# Altium project CapstoneRadar.PrjPcb
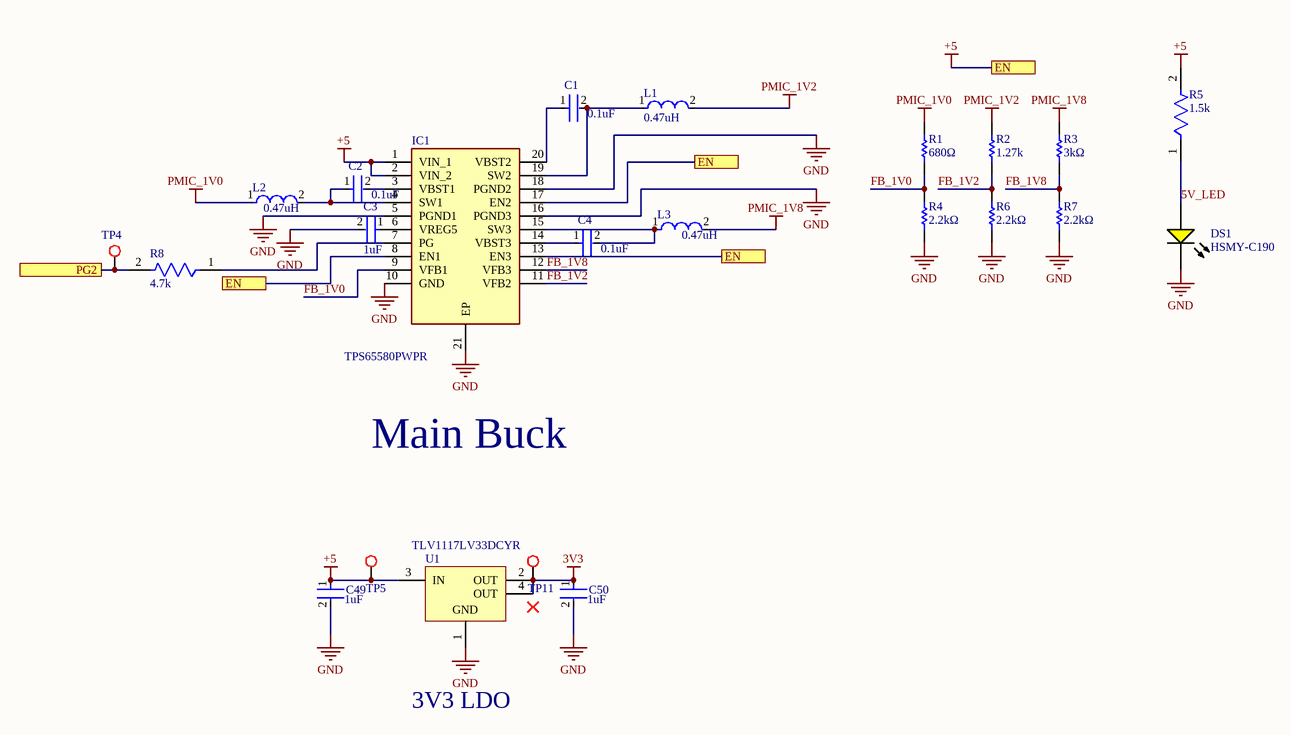
[diagram p0: Power.SchDoc]
4 sheets, 111 parts. Net scope: flat (ports and power ports of the same name join across sheets).
Board file: RadarPCB.PcbDoc
Sheets:
  Power.SchDoc
  IWRL6432.SchDoc
  Filters.SchDoc
  Connectors.SchDoc

## Sheet Power.SchDoc
size A4; SheetNumber: 1; SheetTotal: 4

### Parts
C1  0.1uF  [FP-0603-L_1_6_0_1-W_0_8_0-IPC_C]
C2  0.1uF  [FP-0603-L_1_6_0_1-W_0_8_0-IPC_C]
C3  1uF  [FP-CL10-IPC_C]
C4  0.1uF  [FP-0603-L_1_6_0_1-W_0_8_0-IPC_C]
C49  1uF  [FP-CL10-IPC_C]
C50  1uF  [FP-CL10-IPC_C]
DS1  HSMY-C190  [AVAG-HSMX-C190_V]
IC1  TPS65580PWPR  [SOP65P640X120-21N]
L1  0.47uH  [FP-IHLP-3232DZ-FP_2_413x5-MFG]
L2  0.47uH  [FP-IHLP-3232DZ-FP_2_413x5-MFG]
L3  0.47uH  [FP-IHLP-3232DZ-FP_2_413x5-MFG]
R1  680Ω  [RESC1608X55X30NL20T10]
R2  1.27k  [RESC1609X50X30NL10T20]
R3  3kΩ  [RESC1608X55X30NL20T10]
R4  2.2kΩ  [RESC1609X50X30NL10T20]
R5  1.5k  [FP-RC1608-IPC_B]
R6  2.2kΩ  [RESC1609X50X30NL10T20]
R7  2.2kΩ  [RESC1609X50X30NL10T20]
R8  4.7k  [FP-CRCW0603-HPe3-IPC_A]
TP4  TP_1  [Testpoint]  (value not drawn)
TP5  TP  [Testpoint]  (value not drawn)  (no BOM)
TP11  TP  [Testpoint]  (value not drawn)  (no BOM)
U1  TLV1117LV33DCYR  [DCY0004A_N]

### Ports
EN (see Power[1B], Power[3A]), EN (see Power[1B], Power[3A], Power[3B]), EN (see Power[3A], Power[3B]), PG2 (see IWRL6432[4C])

### Nets
3V3: C50.1 TP11.0 U1.2(OUT) U1.4(OUT)
+5: C49.1 IC1.1(VIN_1) IC1.2(VIN_2) IC1.8(EN1) IC1.13(EN3) IC1.17(EN2) R5.2 TP5.0 U1.3(IN) ; port EN
GND: C3.2 C49.2 C50.2 DS1.2(K) IC1.5(PGND1) IC1.10(GND) IC1.16(PGND3) IC1.18(PGND2) IC1.21(EP) R4.1 R6.1 R7.1 U1.1(GND)
PMIC_1V0: L2.1 R1.2
PMIC_1V2: L1.2 R2.2
PMIC_1V8: L3.2 R3.2
5V_LED: DS1.1(A) R5.1
FB_1V0: IC1.9(VFB1) R1.1 R4.2
FB_1V2: IC1.11(VFB2) R2.1 R6.2
FB_1V8: IC1.12(VFB3) R3.1 R7.2
NetC1_1: C1.1 IC1.20(VBST2)
NetC1_2: C1.2 IC1.19(SW2) L1.1
NetC2_1: C2.1 IC1.4(SW1) L2.2
NetC2_2: C2.2 IC1.3(VBST1)
NetC3_1: C3.1 IC1.6(VREG5)
NetC4_1: C4.1 IC1.14(VBST3)
NetC4_2: C4.2 IC1.15(SW3) L3.1
NetIC1_7: IC1.7(PG) R8.1
NetIC2_L10: R8.2 TP4.0 ; port PG2

### Notes on the sheet
- Main Buck
- 3V3 LDO

### Library data of the parts
C1 C2 C4 = CMP-14477-001640-2: None; Dielectric: X7R; Tolerance: 10%; Voltage Rating (DC): 25V; Capacitance: 100nF; Mount: Surface Mount; Thickness: 0.035inch; Packaging: Tape and Reel; Termination: SMD/SMT; Halogen Free: Halogen Free; RoHS Compliant: Yes; Case Code (Metric): 1608; Min Operating Temperature: -55°C; Width: 0.031inch; Voltage Rating: 25V; Package Quantity: 1; Case Code (Imperial): 0603; Ratings: AEC-Q200; Lead Free: Lead Free; Length: 0.063inch; Height: 0.8mm; Case/Package: 0603; Max Operating Temperature: 125°C
C3 C49 C50 = CMP-13271-003399-1: Cap Ceramic 1uF 10V X5R ±10% Pad SMD 0603 +85°C T/R; Min Operating Temperature: -55°C; Max Operating Temperature: 85°C; Dielectric: X5R; Contact Plating: Tin; Height: 0.8mm; Voltage: 10V; Packaging: Tape and Reel; Voltage Rating: 10V; Capacitance: 1uF; Package Quantity: 1; Width: 0.031inch; Length: 1.6mm; Depth: 0.8mm; Case/Package: 0603; Case Code (Imperial): 0603; Thickness: 0.035inch; Radiation Hardening: No; Tolerance: 10%; Case Code (Metric): 1608; Mount: Surface Mount
DS1 = CMP-1744-00003-1: LED Uni-Color Yellow, 65 mW, 20 mA, -40 to 85 degC, 2-Pin SMD, RoHS, Tape and Reel; Tolerance: 1%; Voltage Rating: 50 V; Power Rating: 100 mW; Case\Package: 0603; Resistance: 390 Ohm; Min Operating Temperature: -55 degC; Length: 1.6 mm; ComponentLink3Description: Package Specification; Mount: Surface Mount; PackageReference: HSMX-C190; ComponentLink2Description: Datasheet; DatasheetVersion: Mar-12; Case Code (Metric): 1608; Pins: 2; Package Quantity: 5000; ComponentLink2URL: http://docs.avagotech.com/docs/AV02-0551EN; ComponentLink1Description: Manufacturer URL; RoHSCompliant: true; Packaging: Tape and Reel; PackageDescription: 2-Pin Surface Mount Device, Body 1.6 x 0.8 mm, Height 0.9 mm; REACH SVHC: No SVHC; ComponentLink3URL: http://www.fairchildsemi.com/dwg/MA/MA03D.pdf; Voltage Rating (DC): 50 V; Width: 0.8 mm; ComponentLink1URL: http://www.avagotech.com/; Max Operating Temperature: 155 degC; Case Code (Imperial): 0603; Height: 0.45 mm
IC1 = TPS65580PWPR: Integrated Circuit; Manufacturer_Name: Texas Instruments; Datasheet Link: http://www.ti.com/lit/gpn/tps65580; Height: 1.2mm; Manufacturer_Part_Number: TPS65580PWPR; Mouser Part Number: 595-TPS65580PWPR; Mouser Price/Stock: https://www.mouser.co.uk/ProductDetail/Texas-Instruments/TPS65580PWPR?qs=igp4D3uu33KIVxsJeGysbA%3D%3D; Arrow Part Number: TPS65580PWPR; Arrow Price/Stock: https://www.arrow.com/en/products/tps65580pwpr/texas-instruments?region=nac
L1-L3 = CMP-02424-000394-1: Commercial Inductors, Low DCR Series 0.47uH 25A 2.38mΩ 20%; Shielding: Shielded; Saturation Current: 14A; Core Material: Ferrite; Test Frequency: 100kHz; Self Resonant Frequency: 80MHz; Inductance: 470nH; DC Resistance (DCR): 2.38mR; Tolerance: 20%; Length: 0.34inch; Width: 0.322inch; Height: 4mm; Case/Package: 3232; Height - Seated (Max): 0.157inch; Termination: SMD/SMT; Inductance Tolerance: 20%; Depth: 8.94mm; Number of Pins: 2; Radiation Hardening: No; Min Operating Temperature: -55°C; Package Quantity: 500; Current Rating: 25A; Mount: Surface Mount; RMS Current (Irms): 25A; Military Standard: Not; Max Operating Temperature: 125°C; Lead Free: Lead Free; Max DC Current: 14A; Packaging: Tape and Reel
R1 = CMP-2000-01638-1: Manufacturer: KOA Speer; Part Number: RK73H1JTTD6800F
R2 = CMP-1012-00521-2: Part Number: CRCW06031K27FKEA; Manufacturer: Vishay Dale
R3 = CMP-2000-01790-1: Manufacturer: KOA Speer; Part Number: SG73P1JTTD3001F
R4 R6 R7 = CMP-2000-03167-1: Part Number: CRCW06032K20FKEA; Manufacturer: Vishay Dale
R5 = CMP-13261-004935-1: Res Thick Film 0603 1.5kΩ 1% 0.1W ±100ppm/°C Molded SMD T/R; Resistance: 1.5kR; Voltage Rating (DC): 50V; Power Rating: 100mW; Contact Plating: Tin; Depth: 0.8mm; Width: 800um; Tolerance: 1%; Lead Free: Lead Free; Composition: Thick Film; Military Standard: Not; Temperature Coefficient: 100ppm/°C; Radiation Hardening: No; Length: 1.6mm; Case/Package: 0603; Max Operating Temperature: 155°C; Packaging: Tape and Reel; Min Operating Temperature: -55°C
R8 = CMP-2000-03414-2: RES Thick Film, 4.7kΩ, 5%, 0.33W, 200ppm/°C, 0603; Max Power Dissipation: 250mW; Voltage Rating: 75V; Resistance: 4.7kR; Case/Package: 0603; Lead Free: Lead Free; Tolerance: 5%; Max Operating Temperature: 155°C; RoHS Compliant: Yes; Power Rating: 250mW; Features: Automotive AEC-Q200; Resistor Type: Thick Film; Weight: 7.1E-05oz; Width: 0.033inch; Packaging: Tape and Reel; Case Code (Imperial): 0603; Package Quantity: 1; Contact Plating: Tin; Number of Terminations: 2; Min Operating Temperature: -55°C; Radiation Hardening: No; Case Code (Metric): 1608; Temperature Coefficient: 200ppm/°C; Height: 0.022inch; Length: 0.063inch; Series: CRCW-HP
TP4 TP5 TP11 = Testpoint
U1 = CMP-0395-00503-2: Single Output LDO, 1 A, Fixed 3.3 V Output, 2 to 5.5 V Input, 4-pin SOT-223 (DCY), -40 to 125 degC, Green (RoHS & no Sb/Br); Manufacturer: Texas Instruments; Vout Adj(Min)(V): 3.3; Vdo(Typ)(mV): 1200; Iq(Typ)(mA): 0.05; Accuracy(%): 2; Iout(Max)(A): 1; SubFamily: Single Channel LDO; Vin(Max)(V): 5.5; PackageReference: DCY0004A; PackageDescription: 4-Pin Plastic Small Outline, Body 3.5 x 6.5 mm, Pitch 2.3 mm; Vout Adj(Max)(V): 3.3; Mounting Technology: Surface Mount; ComponentLink2Description: Datasheet; ComponentLink1Description: Manufacturer URL; PartNumber: TLV1117LV33DCYR; ComponentLink3Description: Package Specification; ComponentLink1URL: http://www.ti.com/; ComponentLink2URL: http://www.ti.com/general/docs/lit/getliterature.tsp?genericPartNumber=TLV1117LV33&fileType=pdf; Fixed Output Options(V): 3.3; PackageVersion: 4202506/B; Vin(Min)(V): 2; DatasheetVersion: SBVS160A; Eco-Plan: Green (RoHS & no Sb/Br); ComponentLink3URL: http://www.ti.com/litv/pdf/mpds094a; Code_JEDEC: TO-261

## Sheet IWRL6432.SchDoc
size A4; SheetNumber: 2; SheetTotal: 4
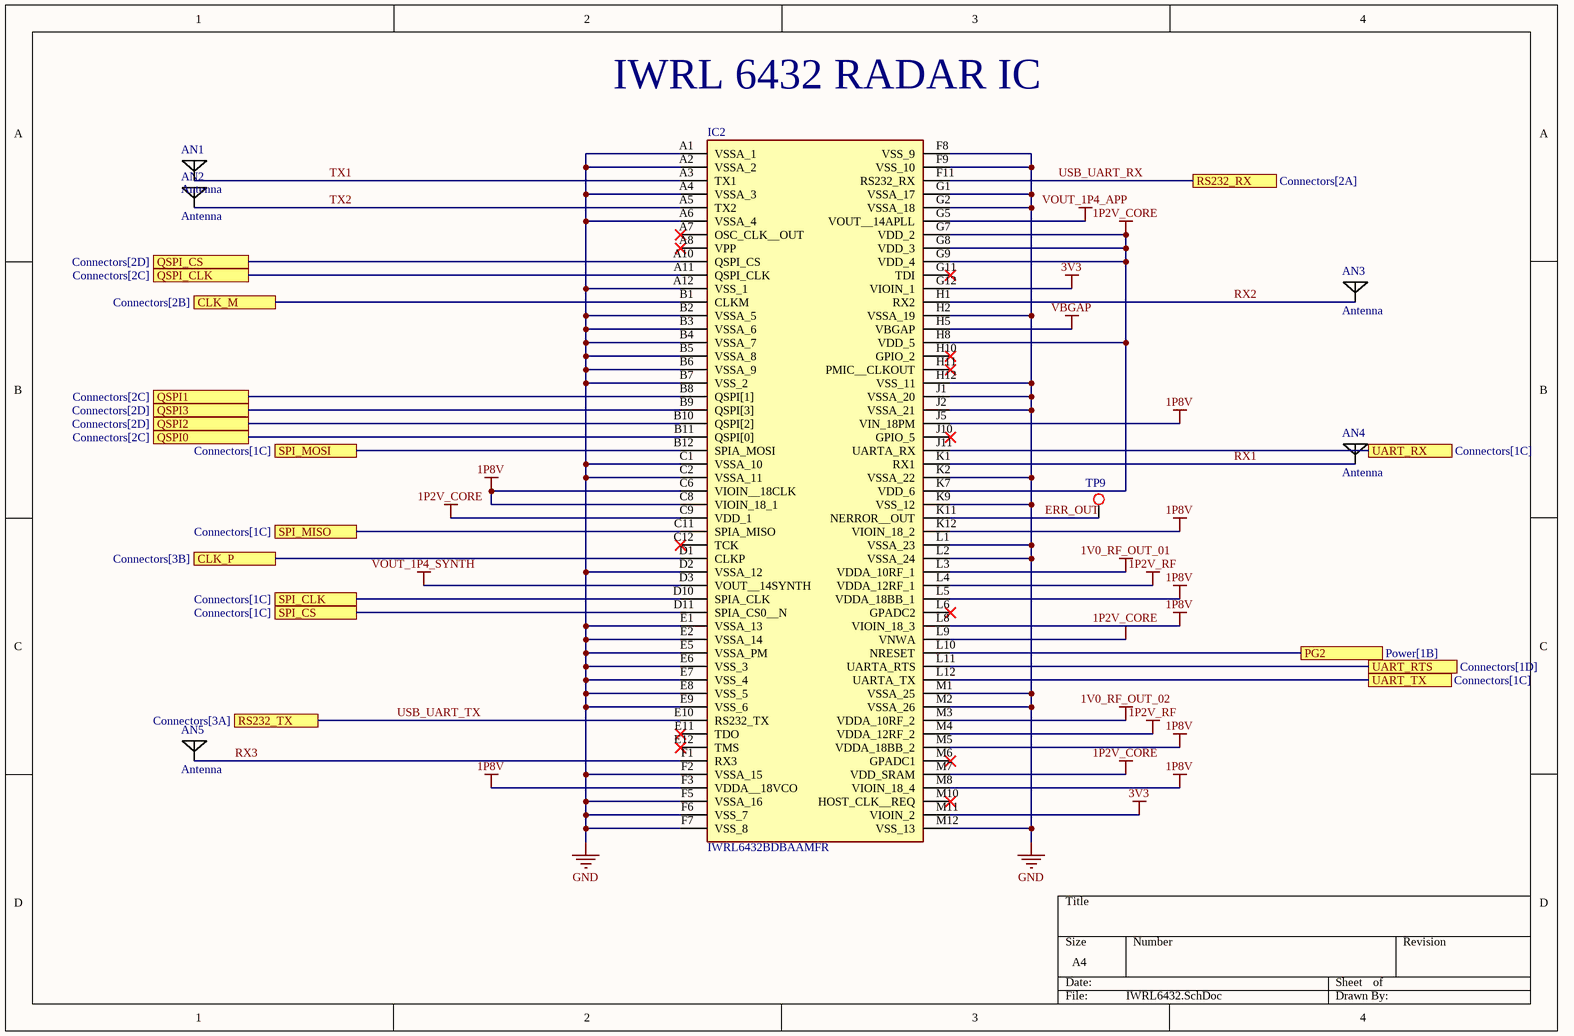
[diagram p1: IWRL6432.SchDoc]

### Parts
AN1  Antenna  [Antenna]
AN2  Antenna  [Antenna]
AN3  Antenna  [Antenna]
AN4  Antenna  [Antenna]
AN5  Antenna  [Antenna]
IC2  IWRL6432BDBAAMFR  [BGA102C50P12X12_645X645X97]
TP9  TP_1  [Testpoint]  (value not drawn)

### Ports
CLK_M (see Connectors[2B]), CLK_P (see Connectors[3B]), PG2 (see Power[1B]), QSPI0 (see Connectors[2C]), QSPI1 (see Connectors[2C]), QSPI2 (see Connectors[2D]), QSPI3 (see Connectors[2D]), QSPI_CLK (see Connectors[2C]), QSPI_CS (see Connectors[2D]), RS232_RX (see Connectors[2A]), RS232_TX (see Connectors[3A]), SPI_CLK (see Connectors[1C]), SPI_CS (see Connectors[1C]), SPI_MISO (see Connectors[1C]), SPI_MOSI (see Connectors[1C]), UART_RTS (see Connectors[1D]), UART_RX (see Connectors[1C]), UART_TX (see Connectors[1C])

### Nets
1P2V_CORE: IC2.C9(VDD_1) IC2.G7(VDD_2) IC2.G8(VDD_3) IC2.G9(VDD_4) IC2.H8(VDD_5) IC2.K7(VDD_6) IC2.L9(VNWA) IC2.M7(VDD_SRAM)
1P2V_RF: IC2.L4(VDDA_12RF_1) IC2.M4(VDDA_12RF_2)
1P8V: IC2.C6(VIOIN__18CLK) IC2.C8(VIOIN_18_1) IC2.F3(VDDA__18VCO) IC2.J5(VIN_18PM) IC2.K12(VIOIN_18_2) IC2.L5(VDDA_18BB_1) IC2.L8(VIOIN_18_3) IC2.M5(VDDA_18BB_2) IC2.M8(VIOIN_18_4)
1V0_RF_OUT_01: IC2.L3(VDDA_10RF_1)
1V0_RF_OUT_02: IC2.M3(VDDA_10RF_2)
3V3: IC2.G12(VIOIN_1) IC2.M11(VIOIN_2)
GND: IC2.A1(VSSA_1) IC2.A2(VSSA_2) IC2.A4(VSSA_3) IC2.A6(VSSA_4) IC2.A12(VSS_1) IC2.B2(VSSA_5) IC2.B3(VSSA_6) IC2.B4(VSSA_7) IC2.B5(VSSA_8) IC2.B6(VSSA_9) IC2.B7(VSS_2) IC2.C1(VSSA_10) IC2.C2(VSSA_11) IC2.D2(VSSA_12) IC2.E1(VSSA_13) IC2.E2(VSSA_14) IC2.E5(VSSA_PM) IC2.E6(VSS_3) IC2.E7(VSS_4) IC2.E8(VSS_5) IC2.E9(VSS_6) IC2.F2(VSSA_15) IC2.F5(VSSA_16) IC2.F6(VSS_7) IC2.F7(VSS_8) IC2.F8(VSS_9) IC2.F9(VSS_10) IC2.G1(VSSA_17) IC2.G2(VSSA_18) IC2.H2(VSSA_19) IC2.H12(VSS_11) IC2.J1(VSSA_20) IC2.J2(VSSA_21) IC2.K2(VSSA_22) IC2.K9(VSS_12) IC2.L1(VSSA_23) IC2.L2(VSSA_24) IC2.M1(VSSA_25) IC2.M2(VSSA_26) IC2.M12(VSS_13)
VBGAP: IC2.H5(VBGAP)
VOUT_1P4_APP: IC2.G5(VOUT__14APLL)
VOUT_1P4_SYNTH: IC2.D3(VOUT__14SYNTH)
ERR_OUT: IC2.K11(NERROR__OUT) TP9.0
QSPI_0: IC2.B11(QSPI[0]) ; port QSPI0
QSPI_1: IC2.B8(QSPI[1]) ; port QSPI1
QSPI_2: IC2.B10(QSPI[2]) ; port QSPI2
QSPI_3: IC2.B9(QSPI[3]) ; port QSPI3
QSPI_CLK: IC2.A11(QSPI_CLK) ; port QSPI_CLK
QSPI_CS: IC2.A10(QSPI_CS) ; port QSPI_CS
RX1: AN4.0 IC2.K1(RX1)
RX2: AN3.0 IC2.H1(RX2)
RX3: AN5.0 IC2.F1(RX3)
SPI_CLK: IC2.D10(SPIA_CLK) ; port SPI_CLK
SPI_CS: IC2.D11(SPIA_CS0__N) ; port SPI_CS
SPI_MISO: IC2.C11(SPIA_MISO) ; port SPI_MISO
SPI_MOSI: IC2.B12(SPIA_MOSI) ; port SPI_MOSI
TX1: AN1.0 IC2.A3(TX1)
TX2: AN2.0 IC2.A5(TX2)
UART_RTS: IC2.L11(UARTA_RTS) ; port UART_RTS
UART_RX: IC2.J11(UARTA_RX) ; port UART_RX
UART_TX: IC2.L12(UARTA_TX) ; port UART_TX
USB_UART_RX: IC2.F11(RS232_RX) ; port RS232_RX
USB_UART_TX: IC2.E10(RS232_TX) ; port RS232_TX
NetC53_1: IC2.B1(CLKM) ; port CLK_M
NetC54_1: IC2.D1(CLKP) ; port CLK_P
NetIC2_L10: IC2.L10(NRESET) ; port PG2

Not connected (* = marked no-connect by the designer): IC2 A7(OSC_CLK__OUT)* A8(VPP)* C12(TCK)* E11(TDO)* E12(TMS)* G11(TDI)* H10(GPIO_2)* H11(PMIC__CLKOUT)* J10(GPIO_5)* L6(GPADC2)* M6(GPADC1)* M10(HOST_CLK__REQ)*

### Notes on the sheet
- IWRL 6432 RADAR IC

### Library data of the parts
IC2 = IWRL6432BDBAAMFR: Integrated Circuit; Manufacturer_Name: Texas Instruments; Datasheet Link: https://www.ti.com/lit/ds/symlink/iwrl6432.pdf; Height: 0.97mm; Manufacturer_Part_Number: IWRL6432BDBAAMFR
TP9 = Testpoint

## Sheet Filters.SchDoc
size A4; SheetNumber: 3; SheetTotal: 4
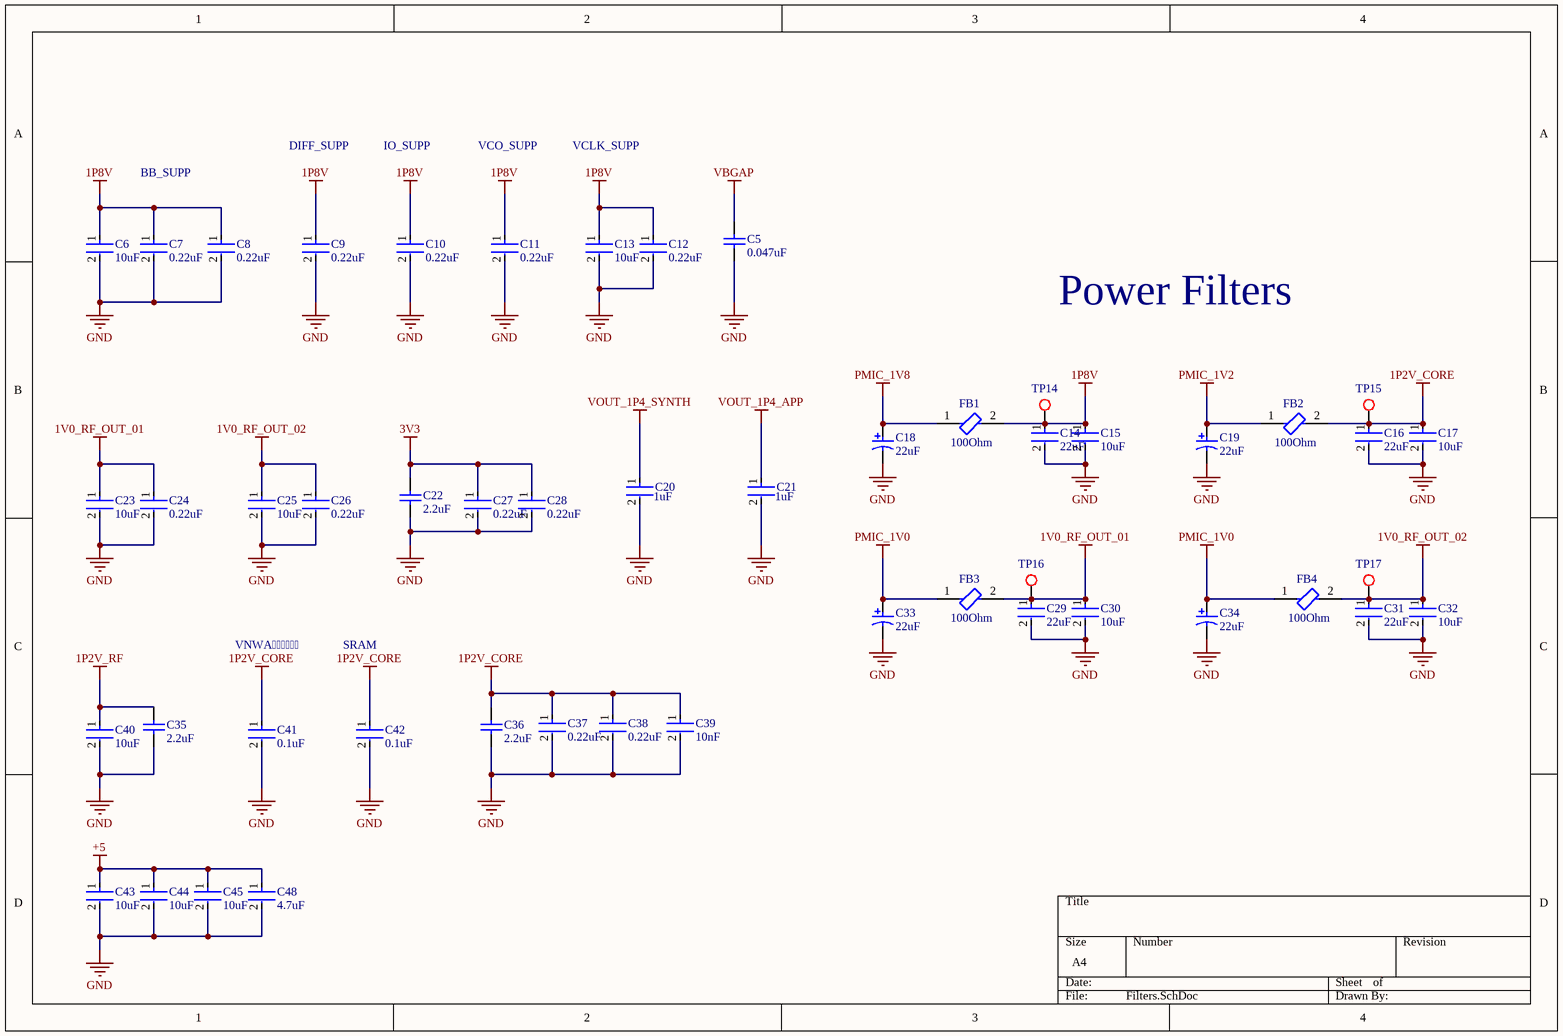
[diagram p2: Filters.SchDoc]

### Parts
C5  0.047uF  [CAPC1608X90X35NL15T15]
C6  10uF  [FP-GRM18-0_15-MFG]
C7  0.22uF  [FP-C0603C-CF-MFG]
C8  0.22uF  [FP-C0603C-CF-MFG]
C9  0.22uF  [FP-C0603C-CF-MFG]
C10  0.22uF  [FP-C0603C-CF-MFG]
C11  0.22uF  [FP-C0603C-CF-MFG]
C12  0.22uF  [FP-C0603C-CF-MFG]
C13  10uF  [FP-GRM18-0_15-MFG]
C14  22uF  [FP-CL21-IPC_C]
C15  10uF  [FP-GRM18-0_15-MFG]
C16  22uF  [FP-CL21-IPC_C]
C17  10uF  [FP-GRM18-0_15-MFG]
C18  22uF  [NIC-CAPA2-4X5.8_V]
C19  22uF  [NIC-CAPA2-4X5.8_V]
C20  1uF  [FP-CL10-IPC_C]
C21  1uF  [FP-CL10-IPC_C]
C22  2.2uF  [CAPC0603(1608)100_N]
C23  10uF  [FP-GRM18-0_15-MFG]
C24  0.22uF  [FP-C0603C-CF-MFG]
C25  10uF  [FP-GRM18-0_15-MFG]
C26  0.22uF  [FP-C0603C-CF-MFG]
C27  0.22uF  [FP-C0603C-CF-MFG]
C28  0.22uF  [FP-C0603C-CF-MFG]
C29  22uF  [FP-CL21-IPC_C]
C30  10uF  [FP-GRM18-0_15-MFG]
C31  22uF  [FP-CL21-IPC_C]
C32  10uF  [FP-GRM18-0_15-MFG]
C33  22uF  [NIC-CAPA2-4X5.8_V]
C34  22uF  [NIC-CAPA2-4X5.8_V]
C35  2.2uF  [CAPC0603(1608)100_N]
C36  2.2uF  [CAPC0603(1608)100_N]
C37  0.22uF  [FP-C0603C-CF-MFG]
C38  0.22uF  [FP-C0603C-CF-MFG]
C39  10nF  [FP-CGA3E-0_3-0_1-IPC_A]
C40  10uF  [FP-GRM18-0_15-MFG]
C41  0.1uF  [FP-CC0603-DA-MFG]
C42  0.1uF  [FP-CC0603-DA-MFG]
C43  10uF  [FP-GRM18-0_15-MFG]
C44  10uF  [FP-GRM18-0_15-MFG]
C45  10uF  [FP-GRM18-0_15-MFG]
C48  4.7uF  [FP-CL10-IPC_A]
FB1  100Ohm  [FP-MPZ1608-0_8-MFG]
FB2  100Ohm  [FP-MPZ1608-0_8-MFG]
FB3  100Ohm  [FP-MPZ1608-0_8-MFG]
FB4  100Ohm  [FP-MPZ1608-0_8-MFG]
TP14  TP_1  [Testpoint]  (value not drawn)
TP15  TP_1  [Testpoint]  (value not drawn)
TP16  TP_1  [Testpoint]  (value not drawn)
TP17  TP_1  [Testpoint]  (value not drawn)

### Nets
1P2V_CORE: C16.1 C17.1 C36.2 C37.1 C38.1 C39.1 C41.1 C42.1 FB2.2 TP15.0
1P2V_RF: C35.2 C40.1
1P8V: C6.1 C7.1 C8.1 C9.1 C10.1 C11.1 C12.1 C13.1 C14.1 C15.1 FB1.2 TP14.0
1V0_RF_OUT_01: C23.1 C24.1 C29.1 C30.1 FB3.2 TP16.0
1V0_RF_OUT_02: C25.1 C26.1 C31.1 C32.1 FB4.2 TP17.0
3V3: C22.2 C27.1 C28.1
+5: C43.1 C44.1 C45.1 C48.1
GND: C5.1 C6.2 C7.2 C8.2 C9.2 C10.2 C11.2 C12.2 C13.2 C14.2 C15.2 C16.2 C17.2 C18.2 C19.2 C20.2 C21.2 C22.1 C23.2 C24.2 C25.2 C26.2 C27.2 C28.2 C29.2 C30.2 C31.2 C32.2 C33.2 C34.2 C35.1 C36.1 C37.2 C38.2 C39.2 C40.2 C41.2 C42.2 C43.2 C44.2 C45.2 C48.2
PMIC_1V0: C33.1 C34.1 FB3.1 FB4.1
PMIC_1V2: C19.1 FB2.1
PMIC_1V8: C18.1 FB1.1
VBGAP: C5.2
VOUT_1P4_APP: C21.1
VOUT_1P4_SYNTH: C20.1

### Notes on the sheet
- BB_SUPP
- DIFF_SUPP
- IO_SUPP
- VCO_SUPP
- VCLK_SUPP
- Power Filters
- VNWA
- SRAM

### Library data of the parts
C5 = CMP-2006-02145-1: Manufacturer: AVX Interconnect / Elco; Part Number: 06035F473K4T2A
C6 C13 C15 C17 C23 C25 C30 C32 C40 C43-C45 = CMP-2000-05448-2: CAP CER 10UF 10V X5R 0603; Manufacturer Part Number: GRM188R61A106KE69D; Manufacturer: Murata; Temperature Coefficient: 15%; Material: Ceramic; Tolerance: 10%; Device Class L1: Passive Components; ComponentLink2Description: Datasheet; Height: 0.95mm; Package: GRM18-0.15; Octopart: https://octopart.com/grm188r61a106ke69d-murata-22851381; Value: 10uF; Digikey Description: CAP CER 10UF 10V X5R 0603; Temperature Range High: +85°C; Temperature Range Low: -55°C; Temperature Characteristic: X5R; Capacitance: 10uF; RoHS: TRUE; Device Class L2: Capacitors; ComponentLink2URL: https://search.murata.co.jp/Ceramy/image/img/A01X/G101/ENG/GRM188R61A106KE69-01A.pdf; Device Class L3: Ceramic Capacitors; Lead Free: Yes; Mouser Description: Multilayer Ceramic Capacitors MLCC - SMD/SMT 0603 10uF 10volts X5R + - 10%; Category: Cap; Voltage Rating: 10V; Temperature: -55°C to +85°C; Automotive: No
C7-C12 C24 C26-C28 C37 C38 = CMP-03020-026996-1: C0603 0.22 μF X7R 30ppm/°C 10.00% 10 V; Manufacturer Part Number: C0603C224K8RAC; Manufacturer: KEMET; Capacitance: 0.22 μF; Automotive Grade: Grade 1; Material: Ceramic; Value: 0.22 μF; Voltage Rating: 10 V; Tolerance: 0.1; Device Class L2: Capacitors; Temperature Range High: +125°C; RoHS: TRUE; Device Class L1: Passive Components; Temperature: -55°C to +125°C; Temperature Coefficient: 30ppm/°C; ComponentLink2Description: Datasheet; Device Class L3: Ceramic Capacitors; ComponentLink2URL: https://api.kemet.com/component-edge/download/datasheet/C0603C100J5GACAUTO.pdf; Category: Cap; Lead Free: Yes; Automotive: Yes; Height: 0.87mm; Temperature Characteristic: X7R; Mouser Description: Multilayer Ceramic Capacitors MLCC - SMD/SMT 50volts 0.22 uF C0G X7R; Octopart: https://octopart.com/c0603c224k8rac-kemet-7455784; Package: C0603C-CF; Temperature Range Low: -55°C
C14 C16 C29 C31 = CMP-13271-003019-1: CL21 Series 0805 22uF 4V ±20% Tolerance X6S Multilayer Ceramic Chip Capacitor; Capacitance: 22uF; Packaging: Tape and Reel; Depth: 1.25mm; Mount: Surface Mount; Width: 0.049inch; Min Operating Temperature: -55°C; Case/Package: 0805; Max Operating Temperature: 105°C; Package Quantity: 1; Case Code (Metric): 2012; Voltage Rating: 4V; Radiation Hardening: No; Dielectric: X6S; Thickness: 0.055inch; Case Code (Imperial): 0805; Length: 2mm; Tolerance: 20%; Height: 1.25mm
C18 C19 C33 C34 = CMP-0687-00010-1: Aluminum Electrolytic Capacitor, UD Series, Low Impedance, 22 uF, 10 V, + / - 20%, -55 to 105 degC, Chip Type, 4 x 5.8 mm D x L, Pb-Free, Reel; Manufacturer: Nichicon; PartNumber: UUD1A220MCL1GS; Endurance Time: 2000 h; Packing: Dia382mm Reel; Tolerance Rated Capacitance: -20 to 20%; Rated Ripple Current (at 100kHz): 80 mA; Impedance: 1.8 Ohm; Rated Voltage: 10 V; ComponentLink3URL: http://products.nichicon.co.jp/en/pdf/XJA043/e-ud.pdf; ComponentLink2URL: http://products.nichicon.co.jp/en/pdf/XJA043/e-ud.pdf; ComponentLink2Description: Datasheet; ComponentLink1URL: http://www.nichicon.co.jp/; DatasheetVersion: 08/2012; PackageDescription: 2-Pin Surface Mount Device, Diameter 4 mm, Height 5.8 mm, Pitch 3.6 mm; PackageReference: CAPAE-D4H5.8; ComponentLink1Description: Manufacturer URL; Rated Capacitance: 22 uF; Length: 5.8 mm; Diameter: 4 mm; ComponentLink3Description: Package Specification; Mounting Technology: Surface Mount; RoHS: TRUE
C20 C21 = CMP-13271-003399-1: as C3 on sheet Power; Min Operating Temperature: -55°C; Max Operating Temperature: 85°C; Dielectric: X5R; Contact Plating: Tin; Height: 0.8mm; Voltage: 10V; Packaging: Tape and Reel; Voltage Rating: 10V; Capacitance: 1uF; Package Quantity: 1; Width: 0.031inch; Length: 1.6mm; Depth: 0.8mm; Case/Package: 0603; Case Code (Imperial): 0603; Thickness: 0.035inch; Radiation Hardening: No; Tolerance: 10%; Case Code (Metric): 1608; Mount: Surface Mount
C22 C35 C36 = CMP-1035-02766-1: CAP 2.2uF 16V -20% to +80% 0603 (1608 Metric) Thickness 1mm SMD; Case-Metric: 1608; Case-EIA: 0603; Value: 2.2uF; Rated Voltage: 16 V; Tolerance: -20% to +80%; Technology: SMT; Max Thickness: 1 mm
C39 = CMP-08246-000769-1: Cap Ceramic 10nF 100V X8R 10% Pad SMD 0603 +150°C Automotive T/R; Mount: Surface Mount; Voltage Rating (DC): 100V; Termination: SMD/SMT; Dielectric: X8R; Case/Package: 0603; Ratings: AEC-Q200; Voltage Rating: 100V; Capacitance: 10nF; Packaging: Tape and Reel; Thickness: 0.035inch; Composition: Ceramic; Max Operating Temperature: 150°C; Width: 0.031inch; Height: 0.8mm; Weight: 7.1E-05oz; Depth: 0.8mm; Min Operating Temperature: -55°C; Length: 1.6mm; Case Code (Metric): 1608; Tolerance: 10%; Package Quantity: 4000; Case Code (Imperial): 0603
C41 C42 = CMP-03422-001228-1: CAP CER 0.1UF 10V X7R 0603; Manufacturer Part Number: CC0603KRX7R6BB104; Manufacturer: YAGEO; Material: Ceramic; Tolerance: 0.1; Capacitance: 100 nF; Temperature Coefficient: 15%; Value: 100 nF; Height: 0.9mm; RoHS: TRUE; Footprint Url: http://www.yageo.com/exep/pages/download/literatures/UPY-C_GEN_24.pdf; Octopart: https://octopart.com/cc0603krx7r6bb104-yageo-9291607; Device Class L1: Passive Components; Mouser Description: 0603 0.1 uF 10 V ±10 % Tolerance X7R SMT Multilayer Ceramic Capacitor; ComponentLink2URL: http://www.yageo.com/documents/recent/UPY-GPHC_X7R_6.3V-to-50V_18.pdf; Automotive: No; Voltage: 10 V; Device Class L3: Ceramic Capacitors; Category: Cap; Temperature: -55°C to +125°C; ComponentLink2Description: Datasheet; Voltage Rating: 10 V; Device Class L2: Capacitors; Lead Free: Yes; Temperature Range High: +125°C; Temperature Range Low: -55°C; Digikey Description: CAP CER 0.1UF 10V X7R 0603; Package: CC0603-DA; Temperature Characteristic: X7R
C48 = CMP-13271-001817-1: Cap Ceramic 4.7uF 6.3V X6S ±10% Pad SMD 0603 +105°C T/R; Length: 1.6mm; Tolerance: 10%; Packaging: Tape and Reel; Dielectric: X6S; Lead Free: Lead Free; Package Quantity: 1; Case/Package: 0603; Max Operating Temperature: 105°C; Radiation Hardening: No; Thickness: 0.035inch; Depth: 0.8mm; Capacitance: 4.7uF; Case Code (Metric): 1608; Voltage Rating (DC): 6.3V; Height: 0.8mm; Voltage Rating: 6.3V; Mount: Surface Mount; Min Operating Temperature: -55°C; Case Code (Imperial): 0603; Width: 0.031inch
FB1-FB4 = CMP-08257-000073-1: Power line Ferrite Bead 100Ω @ 100MHz 2A DCR 0.04Ω AEC-Q200 SMD 0603; Impedance: 100R; Tolerance: 25%; Number of Lines: 1; DC Resistance (DCR): 40mR; Termination: SMD/SMT; Case Code (Imperial): 0603; RoHS Compliant: Yes; Weight: 7.1E-05oz; Case Code (Metric): 1608; Width: 0.031inch; Max DC Current: 2A; Mount: Surface Mount; Packaging: Tape and Reel; Package Quantity: 4000; Length: 0.063inch; Max Current Rating: 2A; Min Operating Temperature: -55°C; Max Operating Temperature: 125°C; Case/Package: 0603; Height: 0.037inch; Test Frequency: 100MHz; Ratings: AEC-Q200
TP14-TP17 = Testpoint

## Sheet Connectors.SchDoc
size A4; SheetNumber: 4; SheetTotal: 4
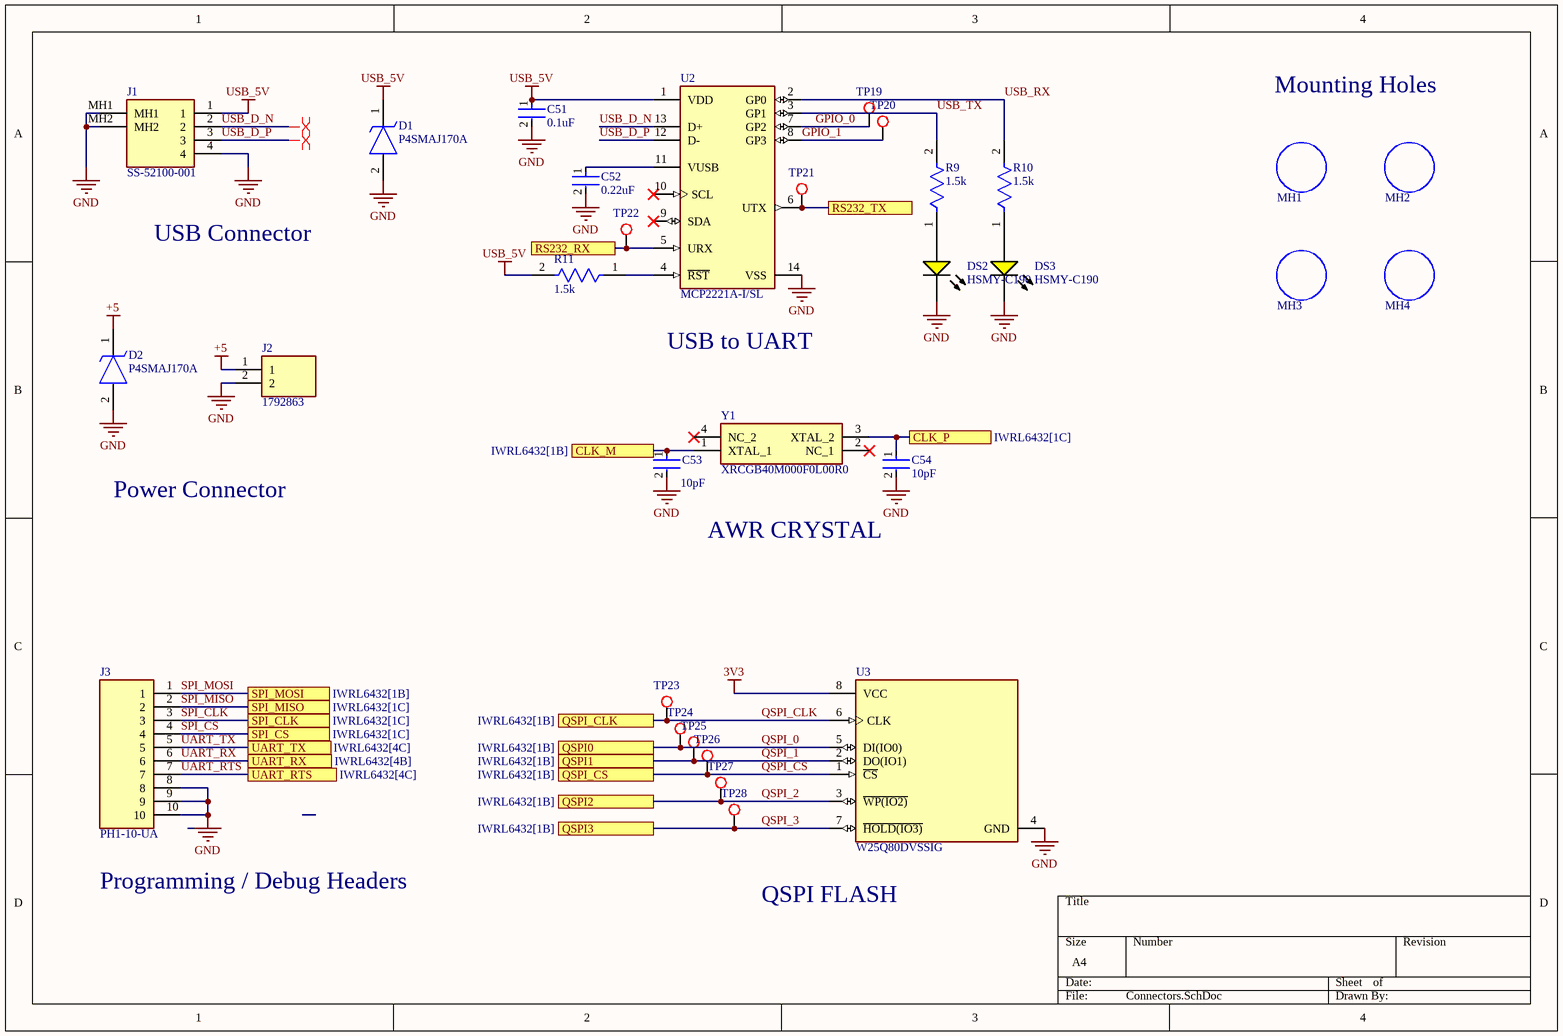
[diagram p3: Connectors.SchDoc]

### Parts
C51  0.1uF  [FP-CC0603-DA-MFG]
C52  0.22uF  [FP-C0603C-CF-MFG]
C53  10pF  [FP-CL10-IPC_B]
C54  10pF  [FP-CL10-IPC_B]
D1  P4SMAJ170A  [DIOM5027X240N]
D2  P4SMAJ170A  [DIOM5027X240N]
DS2  HSMY-C190  [AVAG-HSMX-C190_V]
DS3  HSMY-C190  [AVAG-HSMX-C190_V]
J1  SS-52100-001  [SS52100001]
J2  1792863  [1792863]
J3  PH1-10-UA  [HDRV10W64P0X254_1X10_2540X249X886P]
MH1  MH?  [Mounting Hole]  (value not drawn)
MH2  MH?  [Mounting Hole]  (value not drawn)
MH3  MH?  [Mounting Hole]  (value not drawn)
MH4  MH?  [Mounting Hole]  (value not drawn)
R9  1.5k  [FP-RC1608-IPC_B]
R10  1.5k  [FP-RC1608-IPC_B]
R11  1.5k  [FP-RC1608-IPC_B]
TP19  TP_1  [Testpoint]  (value not drawn)
TP20  TP_1  [Testpoint]  (value not drawn)
TP21  TP_1  [Testpoint]  (value not drawn)
TP22  TP_1  [Testpoint]  (value not drawn)
TP23  TP_1  [Testpoint]  (value not drawn)
TP24  TP_1  [Testpoint]  (value not drawn)
TP25  TP_1  [Testpoint]  (value not drawn)
TP26  TP_1  [Testpoint]  (value not drawn)
TP27  TP_1  [Testpoint]  (value not drawn)
TP28  TP_1  [Testpoint]  (value not drawn)
U2  MCP2221A-I/SL  [FP-C04-065-SL-MFG]
U3  W25Q80DVSSIG  [FP-SS-MFG]
Y1  XRCGB40M000F0L00R0  [XRCGB]

### Ports
CLK_M (see IWRL6432[1B]), CLK_P (see IWRL6432[1C]), QSPI0 (see IWRL6432[1B]), QSPI1 (see IWRL6432[1B]), QSPI2 (see IWRL6432[1B]), QSPI3 (see IWRL6432[1B]), QSPI_CLK (see IWRL6432[1B]), QSPI_CS (see IWRL6432[1B]), RS232_RX (see IWRL6432[4A]), RS232_TX (see IWRL6432[1C]), SPI_CLK (see IWRL6432[1C]), SPI_CS (see IWRL6432[1C]), SPI_MISO (see IWRL6432[1C]), SPI_MOSI (see IWRL6432[1B]), UART_RTS (see IWRL6432[4C]), UART_RX (see IWRL6432[4B]), UART_TX (see IWRL6432[4C])

### Nets
3V3: U3.8(VCC)
+5: D2.1(K) J2.1
GND: C51.2 C52.2 C53.2 C54.2 D1.2(A) D2.2(A) DS2.2(K) DS3.2(K) J1.4 J1.MH1 J1.MH2 J2.2 J3.8 J3.9 J3.10 U2.14(VSS) U3.4(GND)
USB_5V: C51.1 D1.1(K) J1.1 R11.2 U2.1(VDD)
GPIO_0: TP19.0 U2.7(GP2)
GPIO_1: TP20.0 U2.8(GP3)
QSPI_0: TP24.0 U3.5(DI(IO0)) ; port QSPI0
QSPI_1: TP25.0 U3.2(DO(IO1)) ; port QSPI1
QSPI_2: TP27.0 U3.3(~{WP(IO2)}) ; port QSPI2
QSPI_3: TP28.0 U3.7(~{HOLD(IO3)}) ; port QSPI3
QSPI_CLK: TP23.0 U3.6(CLK) ; port QSPI_CLK
QSPI_CS: TP26.0 U3.1(~{CS}) ; port QSPI_CS
SPI_CLK: J3.3 ; port SPI_CLK
SPI_CS: J3.4 ; port SPI_CS
SPI_MISO: J3.2 ; port SPI_MISO
SPI_MOSI: J3.1 ; port SPI_MOSI
UART_RTS: J3.7 ; port UART_RTS
UART_RX: J3.6 ; port UART_RX
UART_TX: J3.5 ; port UART_TX
USB_D_N: J1.2 U2.13(D+)
USB_D_P: J1.3 U2.12(D-)
USB_RX: R10.2 U2.2(GP0)
USB_TX: R9.2 U2.3(GP1)
USB_UART_RX: TP22.0 U2.5(URX) ; port RS232_RX
USB_UART_TX: TP21.0 U2.6(UTX) ; port RS232_TX
NetC52_1: C52.1 U2.11(VUSB)
NetC53_1: C53.1 Y1.1(XTAL_1) ; port CLK_M
NetC54_1: C54.1 Y1.3(XTAL_2) ; port CLK_P
NetDS2_1: DS2.1(A) R9.1
NetDS3_1: DS3.1(A) R10.1
NetR11_1: R11.1 U2.4(~{RST})

Not connected (* = marked no-connect by the designer): U2 9(SDA)* 10(SCL)*; Y1 2(NC_1)* 4(NC_2)*

### Layout directives
differential pair: USB_D_N, USB_D_P

### Notes on the sheet
- Mounting Holes
- USB Connector
- USB to UART
- Power Connector
- AWR CRYSTAL
- Programming / Debug Headers
- QSPI FLASH

### Library data of the parts
C51 = CMP-03422-001228-1: as C41 on sheet Filters; Height: 0.9mm; RoHS: TRUE; Footprint Url: http://www.yageo.com/exep/pages/download/literatures/UPY-C_GEN_24.pdf; Octopart: https://octopart.com/cc0603krx7r6bb104-yageo-9291607; Device Class L1: Passive Components; Mouser Description: 0603 0.1 uF 10 V ±10 % Tolerance X7R SMT Multilayer Ceramic Capacitor; ComponentLink2URL: http://www.yageo.com/documents/recent/UPY-GPHC_X7R_6.3V-to-50V_18.pdf; Automotive: No; Voltage: 10 V; Device Class L3: Ceramic Capacitors; Category: Cap; Temperature: -55°C to +125°C; ComponentLink2Description: Datasheet; Voltage Rating: 10 V; Device Class L2: Capacitors; Lead Free: Yes; Temperature Range High: +125°C; Temperature Range Low: -55°C; Digikey Description: CAP CER 0.1UF 10V X7R 0603; Package: CC0603-DA; Temperature Characteristic: X7R
C52 = CMP-03020-026996-1: as C7 on sheet Filters; Device Class L2: Capacitors; Temperature Range High: +125°C; RoHS: TRUE; Device Class L1: Passive Components; Temperature: -55°C to +125°C; Temperature Coefficient: 30ppm/°C; ComponentLink2Description: Datasheet; Device Class L3: Ceramic Capacitors; ComponentLink2URL: https://api.kemet.com/component-edge/download/datasheet/C0603C100J5GACAUTO.pdf; Category: Cap; Lead Free: Yes; Automotive: Yes; Height: 0.87mm; Temperature Characteristic: X7R; Mouser Description: Multilayer Ceramic Capacitors MLCC - SMD/SMT 50volts 0.22 uF C0G X7R; Octopart: https://octopart.com/c0603c224k8rac-kemet-7455784; Package: C0603C-CF; Temperature Range Low: -55°C
C53 C54 = CMP-13271-001771-1: Cap Ceramic 10pF 50V C0G ±0.25pF Pad SMD 0603 +125°C T/R; Temperature Coefficient: 300ppm/°C; Height: 0.8mm; Package Quantity: 1; Radiation Hardening: No; Voltage: 50V; Case/Package: 0603; Max Operating Temperature: 125°C; Material: Ceramic; Case Code (Metric): 1608; Depth: 0.8mm; Length: 1.6mm; Thickness: 0.035inch; Width: 0.031inch; Lead Free: Lead Free; Packaging: Tape and Reel; Mount: Surface Mount; Voltage Rating: 50V; Min Operating Temperature: -55°C; Dielectric: C0G; Capacitance: 10pF; Case Code (Imperial): 0603; Voltage Rating (DC): 50V
D1 D2 = P4SMAJ170A: TVS Diode (Uni-directional); Manufacturer_Name: Diotec; Datasheet Link: https://diotec.com/request/datasheet/p4smaj65.pdf; Height: 2.4mm; Manufacturer_Part_Number: P4SMAJ170A
DS2 DS3 = CMP-1744-00003-1: as DS1 on sheet Power; Min Operating Temperature: -55 degC; Length: 1.6 mm; ComponentLink3Description: Package Specification; Mount: Surface Mount; PackageReference: HSMX-C190; ComponentLink2Description: Datasheet; DatasheetVersion: Mar-12; Case Code (Metric): 1608; Pins: 2; Package Quantity: 5000; ComponentLink2URL: http://docs.avagotech.com/docs/AV02-0551EN; ComponentLink1Description: Manufacturer URL; RoHSCompliant: true; Packaging: Tape and Reel; PackageDescription: 2-Pin Surface Mount Device, Body 1.6 x 0.8 mm, Height 0.9 mm; REACH SVHC: No SVHC; ComponentLink3URL: http://www.fairchildsemi.com/dwg/MA/MA03D.pdf; Voltage Rating (DC): 50 V; Width: 0.8 mm; ComponentLink1URL: http://www.avagotech.com/; Max Operating Temperature: 155 degC; Case Code (Imperial): 0603; Height: 0.45 mm
J1 = SS-52100-001: Connector; Manufacturer_Name: BelFuse; Datasheet Link: https://componentsearchengine.com/Datasheets/1/SS-52100-001.pdf; Height: 6.9mm; Manufacturer_Part_Number: SS-52100-001; Mouser Part Number: 530-SS-52100-001; Mouser Price/Stock: https://www.mouser.co.uk/ProductDetail/Stewart-Connector-Bel/SS-52100-001?qs=0lQeLiL1qyZpDP8aQUpKcQ%3D%3D; Arrow Part Number: SS-52100-001; Arrow Price/Stock: https://www.arrow.com/en/products/ss-52100-001/stewart-connector-systems?region=nac
J2 = 1792863: Connector; Manufacturer_Name: Phoenix Contact; Datasheet Link: https://www.phoenixcontact.com/online/portal/pi/pxc/product_detail_page/!ut/p/z1/5VddT_IwFP4rvBfcWdp9j0ucREDRGUDZbpa260h1X24V1F9vCzNEo_PCePFmy0nWduec9nl6DuGBIVzDMMdbvsGCFzlO5TwI7cjVL7zJuanNkTlx0c2Vfzm6ufENfaTDWxjCsGYpo4LFHhZsU1QvMBhdXqoPAhMY6GpUUvoAAx9oGk; Height: 10.65mm; Manufacturer_Part_Number: 1792863; Mouser Part Number: 651-1792863; Mouser Price/Stock: https://www.mouser.co.uk/ProductDetail/Phoenix-Contact/1792863?qs=YjJcVSlHJPU69DDcZ8WVCg%3D%3D; Arrow Part Number: 1792863; Arrow Price/Stock: https://www.arrow.com/en/products/1792863/phoenix-contact?region=nac
J3 = PH1-10-UA: Connector; Manufacturer_Name: Adam Tech; Datasheet Link: https://app.adam-tech.com/products/download/data_sheet/201605/ph1-xx-ua-data-sheet.pdf; Height: 8.865mm; Manufacturer_Part_Number: PH1-10-UA; Mouser Part Number: 737-PH1-10-UA; Mouser Price/Stock: https://www.mouser.co.uk/ProductDetail/Adam-Tech/PH1-10-UA?qs=ogqIPVdloe%252Bff9mnAAAy9w%3D%3D; Arrow Part Number: PH1-10-UA; Arrow Price/Stock: null?utm_currency=USD&region=nac
MH1-MH4 = Mounting Hole
R9-R11 = CMP-13261-004935-1: as R5 on sheet Power; Contact Plating: Tin; Depth: 0.8mm; Width: 800um; Tolerance: 1%; Lead Free: Lead Free; Composition: Thick Film; Military Standard: Not; Temperature Coefficient: 100ppm/°C; Radiation Hardening: No; Length: 1.6mm; Case/Package: 0603; Max Operating Temperature: 155°C; Packaging: Tape and Reel; Min Operating Temperature: -55°C
TP19-TP28 = Testpoint
U2 = CMP-06284-000011-1: IC USB TO I2C/UART 14SOIC; Manufacturer: Microchip; Min Supply Voltage: 3V; Usb Standard: USB 2.0; Max Supply Voltage: 5.5V; Nominal Supply Current: 10-13mA; Automotive Grade: Grade 3; Interface: I2C,UART,USB; Standoff Height: 0.1mm; Max Junction Temp: +150°C; Data Rate: 12Mbits/s; Lead Free: Yes; Height: 1.75mm; Octopart: https://octopart.com/mcp2221a-i%2Fsl-microchip-71704986; Package: C04-065-SL; Digikey Description: IC USB TO I2C/UART 14SOIC; Temperature Range Low: -40°C; Temperature: -40°C to +85°C; Category: IC; Temperature Range High: +85°C; Ambient Temperature Range Low: -40°C; Device Class L1: Integrated Circuits (ICs); Footprint Url: http://ww1.microchip.com/downloads/en/DeviceDoc/14L%20SOIC%203_90%20mm%20%28SL%29%20C04-00065d.pdf; Automotive: Yes; ComponentLink2URL: http://ww1.microchip.com/downloads/en/DeviceDoc/20005565B.pdf; Ambient Temperature Range High: +85°C; RoHS: TRUE; Device Class L3: USB Interface ICs; ComponentLink2Description: Datasheet; Device Class L2: Interface ICs; Manufacturer Part Number: MCP2221A-I/SL; Ipc Land Pattern Name: SOIC127P600X175-14
U3 = CMP-2000-07408-2: IC FLASH 8MBIT SPI 104MHZ 8SOIC; Memory Type: Non-Volatile; Memory Size: 8Mb; Frequency: 104MHz; Min Operating Temperature: -40°C; Mount: Surface Mount; RoHS Compliant: Yes; Packaging: Rail/Tube; Case/Package: SOIC; Max Operating Temperature: 85°C; Series: SpiFlash®; Interface: SPI
Y1 = XRCGB40M000F0L00R0: Crystal or Oscillator; Manufacturer_Name: Murata Electronics; Datasheet Link: https://www.murata.com/products/productdata/8801066844190/SPEC-XRCGB40M000F0L00R0.pdf; Height: 0.7mm; Manufacturer_Part_Number: XRCGB40M000F0L00R0; Mouser Part Number: 81-XRCGB40M000F0L0R0; Mouser Price/Stock: https://www.mouser.co.uk/ProductDetail/Murata-Electronics/XRCGB40M000F0L00R0?qs=e%252BE4OD6MgMeIG7IAXBIJgA%3D%3D

## Nets that join several sheets
1P2V_CORE: IWRL6432 (8 pins), Filters (10 pins)
1P2V_RF: IWRL6432 (IC2.L4 IC2.M4), Filters (C35.2 C40.1)
1P8V: IWRL6432 (9 pins), Filters (12 pins)
1V0_RF_OUT_01: IWRL6432 (IC2.L3), Filters (6 pins)
1V0_RF_OUT_02: IWRL6432 (IC2.M3), Filters (6 pins)
3V3: Power (C50.1 TP11.0 U1.2 U1.4), IWRL6432 (IC2.G12 IC2.M11), Filters (C22.2 C27.1 C28.1), Connectors (U3.8)
+5: Power (9 pins), Filters (C43.1 C44.1 C45.1 C48.1), Connectors (D2.1 J2.1)
GND: Power (13 pins), IWRL6432 (40 pins), Filters (42 pins), Connectors (17 pins)
PMIC_1V0: Power (L2.1 R1.2), Filters (C33.1 C34.1 FB3.1 FB4.1)
PMIC_1V2: Power (L1.2 R2.2), Filters (C19.1 FB2.1)
PMIC_1V8: Power (L3.2 R3.2), Filters (C18.1 FB1.1)
VBGAP: IWRL6432 (IC2.H5), Filters (C5.2)
VOUT_1P4_APP: IWRL6432 (IC2.G5), Filters (C21.1)
VOUT_1P4_SYNTH: IWRL6432 (IC2.D3), Filters (C20.1)
NetC53_1: IWRL6432 (IC2.B1), Connectors (C53.1 Y1.1)
NetC54_1: IWRL6432 (IC2.D1), Connectors (C54.1 Y1.3)
NetIC2_L10: Power (R8.2 TP4.0), IWRL6432 (IC2.L10)
QSPI_0: IWRL6432 (IC2.B11), Connectors (TP24.0 U3.5)
QSPI_1: IWRL6432 (IC2.B8), Connectors (TP25.0 U3.2)
QSPI_2: IWRL6432 (IC2.B10), Connectors (TP27.0 U3.3)
QSPI_3: IWRL6432 (IC2.B9), Connectors (TP28.0 U3.7)
QSPI_CLK: IWRL6432 (IC2.A11), Connectors (TP23.0 U3.6)
QSPI_CS: IWRL6432 (IC2.A10), Connectors (TP26.0 U3.1)
SPI_CLK: IWRL6432 (IC2.D10), Connectors (J3.3)
SPI_CS: IWRL6432 (IC2.D11), Connectors (J3.4)
SPI_MISO: IWRL6432 (IC2.C11), Connectors (J3.2)
SPI_MOSI: IWRL6432 (IC2.B12), Connectors (J3.1)
UART_RTS: IWRL6432 (IC2.L11), Connectors (J3.7)
UART_RX: IWRL6432 (IC2.J11), Connectors (J3.6)
UART_TX: IWRL6432 (IC2.L12), Connectors (J3.5)
USB_UART_RX: IWRL6432 (IC2.F11), Connectors (TP22.0 U2.5)
USB_UART_TX: IWRL6432 (IC2.E10), Connectors (TP21.0 U2.6)